# Altium schematic sheet Max31856.SchDoc
size A4; SheetNumber: 3; SheetTotal: 7
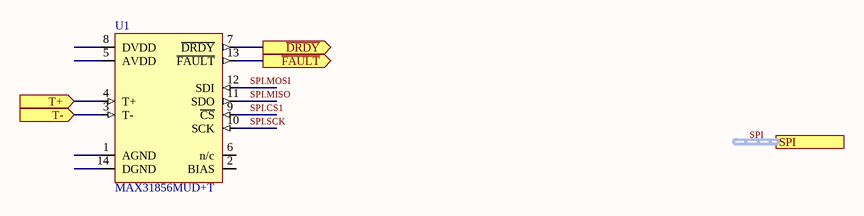
[diagram p0: Max31856.SchDoc]

## Parts
U1  MAX31856MUD+T  [TSSOP - 14]

## Ports
SPI (harness SPI), T+ (in), T- (in), ~{DRDY} (out), ~{FAULT} (out)

## Nets
~{DRDY}: U1.7(~{DRDY}) ; port ~{DRDY}
~{FAULT}: U1.13(~{FAULT}) ; port ~{FAULT}
SPI.CS1: U1.9(~{CS})
SPI.MISO: U1.11(SDO)
SPI.MOSI: U1.12(SDI)
SPI.SCK: U1.10(SCK)
T+: U1.4(T+) ; port T+
T-: U1.3(T-) ; port T-

Not connected (* = marked no-connect by the designer): U1 1(AGND) 2(BIAS) 5(AVDD) 6(n/c) 8(DVDD) 14(DGND)

## Buses and harness runs
harness SPI = port SPI

## Library data of the parts
U1 = CMP-015-00035-A01: Sensor Interface Precision Thermocouple to Digital Converter with Linearization; Samples Frequency: 10Hz; Sample Resolution: 19; Interface: SPI; Signal Type: Differential; Supply Voltage (Max): 3.6V; Supply Voltage (Min): 3.3V; Operating Temperature (Max): 125°C; Mounting Technology: Surface Mount; Pins: 14; RoHS Compliant: Yes; Operating Temperature (Min): -55°C; Case/Package: TSSOP